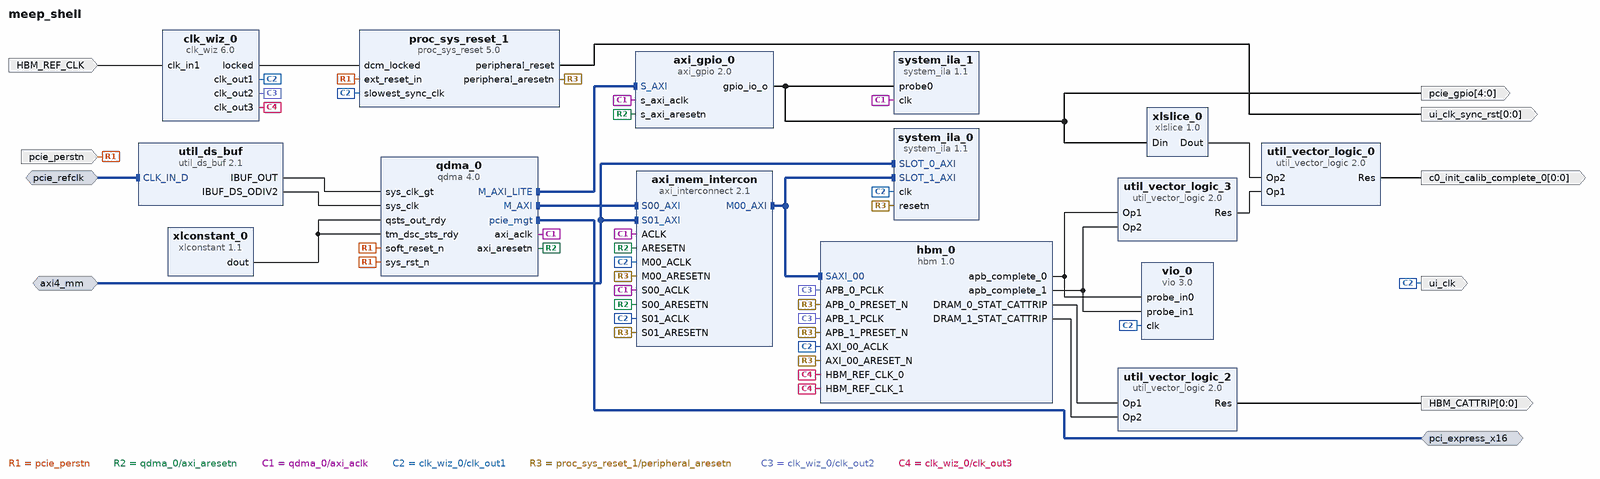
[diagram p0: block diagram of the top level]
# Vivado block design meep_shell, xcu280-fsvh2892-2L-e, Vivado 2020.1
create_bd_design meep_shell

create_bd_intf_port -mode Master -vlnv xilinx.com:interface:pcie_7x_mgt_rtl:1.0 pci_express_x16
create_bd_intf_port -mode Slave -vlnv xilinx.com:interface:diff_clock_rtl:1.0 pcie_refclk
set_property -dict {CONFIG.FREQ_HZ 100000000} [get_bd_intf_ports pcie_refclk]
create_bd_intf_port -mode Slave -vlnv xilinx.com:interface:aximm_rtl:1.0 axi4_mm
set_property -dict [list \
  CONFIG.DATA_WIDTH 512 \
  CONFIG.PROTOCOL AXI4 \
  CONFIG.FREQ_HZ 250000000 \
  CONFIG.ID_WIDTH 7 \
  CONFIG.ADDR_WIDTH 33 \
  CONFIG.AWUSER_WIDTH 0 \
  CONFIG.ARUSER_WIDTH 0 \
  CONFIG.WUSER_WIDTH 0 \
  CONFIG.RUSER_WIDTH 0 \
  CONFIG.BUSER_WIDTH 0 \
  CONFIG.READ_WRITE_MODE READ_WRITE \
  CONFIG.HAS_BURST 1 \
  CONFIG.HAS_LOCK 1 \
  CONFIG.HAS_PROT 1 \
  CONFIG.HAS_CACHE 1 \
  CONFIG.HAS_QOS 1 \
  CONFIG.HAS_REGION 1 \
  CONFIG.HAS_WSTRB 1 \
  CONFIG.HAS_BRESP 1 \
  CONFIG.HAS_RRESP 1 \
  CONFIG.SUPPORTS_NARROW_BURST 1 \
  CONFIG.NUM_READ_OUTSTANDING 1 \
  CONFIG.NUM_WRITE_OUTSTANDING 1 \
  CONFIG.MAX_BURST_LENGTH 256 \
  CONFIG.NUM_READ_THREADS 1 \
  CONFIG.NUM_WRITE_THREADS 1 \
  CONFIG.RUSER_BITS_PER_BYTE 0 \
  CONFIG.WUSER_BITS_PER_BYTE 0 \
] [get_bd_intf_ports axi4_mm]
create_bd_port -dir I -type rst pcie_perstn
set_property -dict {CONFIG.POLARITY ACTIVE_LOW} [get_bd_ports pcie_perstn]
create_bd_port -dir O -from 0 -to 0 c0_init_calib_complete_0
create_bd_port -dir O -type clk ui_clk
create_bd_port -dir O -from 4 -to 0 pcie_gpio
create_bd_port -dir O -from 0 -to 0 HBM_CATTRIP
create_bd_port -dir O -from 0 -to 0 -type rst ui_clk_sync_rst
create_bd_port -dir I -type clk HBM_REF_CLK

create_bd_cell -type ip -vlnv xilinx.com:ip:qdma:4.0 qdma_0
set_property -dict [list \
  CONFIG.PCIE_BOARD_INTERFACE pci_express_x16 \
  CONFIG.PF1_SRIOV_CAP_INITIAL_VF 4 \
  CONFIG.PF2_SRIOV_CAP_INITIAL_VF 4 \
  CONFIG.PF3_SRIOV_CAP_INITIAL_VF 4 \
  CONFIG.SRIOV_CAP_ENABLE true \
  CONFIG.SYS_RST_N_BOARD_INTERFACE pcie_perstn \
  CONFIG.axilite_master_en true \
  CONFIG.barlite_mb_pf0 1 \
  CONFIG.barlite_mb_pf1 1 \
  CONFIG.barlite_mb_pf2 1 \
  CONFIG.barlite_mb_pf3 1 \
  CONFIG.dma_intf_sel_qdma AXI_MM \
  CONFIG.pf0_bar0_prefetchable_qdma true \
  CONFIG.pf0_bar2_64bit_qdma true \
  CONFIG.pf0_bar2_enabled_qdma true \
  CONFIG.pf0_bar2_prefetchable_qdma true \
  CONFIG.tl_pf_enable_reg 4 \
] [get_bd_cells qdma_0]
create_bd_cell -type ip -vlnv xilinx.com:ip:util_ds_buf:2.1 util_ds_buf
set_property -dict {CONFIG.DIFF_CLK_IN_BOARD_INTERFACE pcie_refclk CONFIG.USE_BOARD_FLOW true} [get_bd_cells util_ds_buf]
create_bd_cell -type ip -vlnv xilinx.com:ip:xlconstant:1.1 xlconstant_0
create_bd_cell -type ip -vlnv xilinx.com:ip:axi_gpio:2.0 axi_gpio_0
set_property -dict {CONFIG.C_ALL_OUTPUTS 1 CONFIG.C_GPIO_WIDTH 5} [get_bd_cells axi_gpio_0]
create_bd_cell -type ip -vlnv xilinx.com:ip:hbm:1.0 hbm_0
set_property -dict [list \
  CONFIG.USER_APB_EN false \
  CONFIG.USER_APB_PCLK_0 50 \
  CONFIG.USER_APB_PCLK_1 50 \
  CONFIG.USER_APB_PCLK_PERIOD_0 20.0 \
  CONFIG.USER_APB_PCLK_PERIOD_1 20.0 \
  CONFIG.USER_CLK_SEL_LIST0 AXI_00_ACLK \
  CONFIG.USER_CLK_SEL_LIST1 AXI_16_ACLK \
  CONFIG.USER_HBM_CP_1 6 \
  CONFIG.USER_HBM_DENSITY 8GB \
  CONFIG.USER_HBM_FBDIV_1 36 \
  CONFIG.USER_HBM_HEX_CP_RES_1 0x0000A600 \
  CONFIG.USER_HBM_HEX_FBDIV_CLKOUTDIV_1 0x00000902 \
  CONFIG.USER_HBM_HEX_LOCK_FB_REF_DLY_1 0x00001f1f \
  CONFIG.USER_HBM_LOCK_FB_DLY_1 31 \
  CONFIG.USER_HBM_LOCK_REF_DLY_1 31 \
  CONFIG.USER_HBM_RES_1 10 \
  CONFIG.USER_HBM_STACK 2 \
  CONFIG.USER_MC_ENABLE_08 TRUE \
  CONFIG.USER_MC_ENABLE_09 TRUE \
  CONFIG.USER_MC_ENABLE_10 TRUE \
  CONFIG.USER_MC_ENABLE_11 TRUE \
  CONFIG.USER_MC_ENABLE_12 TRUE \
  CONFIG.USER_MC_ENABLE_13 TRUE \
  CONFIG.USER_MC_ENABLE_14 TRUE \
  CONFIG.USER_MC_ENABLE_15 TRUE \
  CONFIG.USER_MC_ENABLE_APB_01 TRUE \
  CONFIG.USER_PHY_ENABLE_08 TRUE \
  CONFIG.USER_PHY_ENABLE_09 TRUE \
  CONFIG.USER_PHY_ENABLE_10 TRUE \
  CONFIG.USER_PHY_ENABLE_11 TRUE \
  CONFIG.USER_PHY_ENABLE_12 TRUE \
  CONFIG.USER_PHY_ENABLE_13 TRUE \
  CONFIG.USER_PHY_ENABLE_14 TRUE \
  CONFIG.USER_PHY_ENABLE_15 TRUE \
  CONFIG.USER_SAXI_00 true \
  CONFIG.USER_SAXI_01 false \
  CONFIG.USER_SAXI_02 false \
  CONFIG.USER_SAXI_03 false \
  CONFIG.USER_SAXI_04 false \
  CONFIG.USER_SAXI_05 false \
  CONFIG.USER_SAXI_06 false \
  CONFIG.USER_SAXI_07 false \
  CONFIG.USER_SAXI_08 false \
  CONFIG.USER_SAXI_09 false \
  CONFIG.USER_SAXI_10 false \
  CONFIG.USER_SAXI_11 false \
  CONFIG.USER_SAXI_12 false \
  CONFIG.USER_SAXI_13 false \
  CONFIG.USER_SAXI_14 false \
  CONFIG.USER_SAXI_15 false \
  CONFIG.USER_SAXI_16 false \
  CONFIG.USER_SAXI_17 false \
  CONFIG.USER_SAXI_18 false \
  CONFIG.USER_SAXI_19 false \
  CONFIG.USER_SAXI_20 false \
  CONFIG.USER_SAXI_21 false \
  CONFIG.USER_SAXI_22 false \
  CONFIG.USER_SAXI_23 false \
  CONFIG.USER_SAXI_24 false \
  CONFIG.USER_SAXI_25 false \
  CONFIG.USER_SAXI_26 false \
  CONFIG.USER_SAXI_27 false \
  CONFIG.USER_SAXI_28 false \
  CONFIG.USER_SAXI_29 false \
  CONFIG.USER_SAXI_30 false \
  CONFIG.USER_SAXI_31 false \
  CONFIG.USER_SWITCH_ENABLE_01 TRUE \
  CONFIG.USER_TEMP_POLL_CNT_0 50000 \
  CONFIG.USER_TEMP_POLL_CNT_1 50000 \
  CONFIG.USER_XSDB_INTF_EN TRUE \
] [get_bd_cells hbm_0]
create_bd_cell -type ip -vlnv xilinx.com:ip:axi_interconnect:2.1 axi_mem_intercon
set_property -dict [list \
  CONFIG.ENABLE_ADVANCED_OPTIONS 1 \
  CONFIG.NUM_MI 1 \
  CONFIG.NUM_SI 2 \
  CONFIG.SYNCHRONIZATION_STAGES 8 \
  CONFIG.XBAR_DATA_WIDTH 256 \
] [get_bd_cells axi_mem_intercon]
create_bd_cell -type ip -vlnv xilinx.com:ip:util_vector_logic:2.0 util_vector_logic_0
set_property -dict {CONFIG.C_SIZE 1} [get_bd_cells util_vector_logic_0]
create_bd_cell -type ip -vlnv xilinx.com:ip:xlslice:1.0 xlslice_0
set_property -dict {CONFIG.DIN_FROM 0 CONFIG.DIN_WIDTH 5 CONFIG.DOUT_WIDTH 1} [get_bd_cells xlslice_0]
create_bd_cell -type ip -vlnv xilinx.com:ip:clk_wiz:6.0 clk_wiz_0
set_property -dict [list \
  CONFIG.CLKOUT1_DRIVES Buffer \
  CONFIG.CLKOUT1_JITTER 110.209 \
  CONFIG.CLKOUT1_PHASE_ERROR 98.575 \
  CONFIG.CLKOUT1_REQUESTED_OUT_FREQ 250.000 \
  CONFIG.CLKOUT2_DRIVES Buffer \
  CONFIG.CLKOUT2_JITTER 151.636 \
  CONFIG.CLKOUT2_PHASE_ERROR 98.575 \
  CONFIG.CLKOUT2_REQUESTED_OUT_FREQ 50.000 \
  CONFIG.CLKOUT2_USED true \
  CONFIG.CLKOUT3_DRIVES Buffer \
  CONFIG.CLKOUT3_JITTER 130.958 \
  CONFIG.CLKOUT3_PHASE_ERROR 98.575 \
  CONFIG.CLKOUT3_USED true \
  CONFIG.CLKOUT4_DRIVES Buffer \
  CONFIG.CLKOUT5_DRIVES Buffer \
  CONFIG.CLKOUT6_DRIVES Buffer \
  CONFIG.CLKOUT7_DRIVES Buffer \
  CONFIG.CLK_IN1_BOARD_INTERFACE Custom \
  CONFIG.FEEDBACK_SOURCE FDBK_AUTO \
  CONFIG.MMCM_CLKFBOUT_MULT_F 10.000 \
  CONFIG.MMCM_CLKOUT0_DIVIDE_F 4.000 \
  CONFIG.MMCM_CLKOUT1_DIVIDE 20 \
  CONFIG.MMCM_CLKOUT2_DIVIDE 10 \
  CONFIG.NUM_OUT_CLKS 3 \
  CONFIG.PRIM_SOURCE Single_ended_clock_capable_pin \
  CONFIG.USE_LOCKED true \
  CONFIG.USE_RESET false \
  CONFIG.USE_SAFE_CLOCK_STARTUP false \
] [get_bd_cells clk_wiz_0]
create_bd_cell -type ip -vlnv xilinx.com:ip:system_ila:1.1 system_ila_1
set_property -dict {CONFIG.C_MON_TYPE NATIVE CONFIG.C_NUM_OF_PROBES 1 CONFIG.C_PROBE0_TYPE 0} [get_bd_cells system_ila_1]
create_bd_cell -type ip -vlnv xilinx.com:ip:proc_sys_reset:5.0 proc_sys_reset_1
create_bd_cell -type ip -vlnv xilinx.com:ip:util_vector_logic:2.0 util_vector_logic_2
set_property -dict {CONFIG.C_SIZE 1} [get_bd_cells util_vector_logic_2]
create_bd_cell -type ip -vlnv xilinx.com:ip:util_vector_logic:2.0 util_vector_logic_3
set_property -dict {CONFIG.C_SIZE 1} [get_bd_cells util_vector_logic_3]
create_bd_cell -type ip -vlnv xilinx.com:ip:system_ila:1.1 system_ila_0
set_property -dict [list \
  CONFIG.C_MON_TYPE INTERFACE \
  CONFIG.C_NUM_MONITOR_SLOTS 2 \
  CONFIG.C_SLOT_0_APC_EN 0 \
  CONFIG.C_SLOT_0_AXI_AR_SEL_DATA 1 \
  CONFIG.C_SLOT_0_AXI_AR_SEL_TRIG 1 \
  CONFIG.C_SLOT_0_AXI_AW_SEL_DATA 1 \
  CONFIG.C_SLOT_0_AXI_AW_SEL_TRIG 1 \
  CONFIG.C_SLOT_0_AXI_B_SEL_DATA 1 \
  CONFIG.C_SLOT_0_AXI_B_SEL_TRIG 1 \
  CONFIG.C_SLOT_0_AXI_R_SEL_DATA 1 \
  CONFIG.C_SLOT_0_AXI_R_SEL_TRIG 1 \
  CONFIG.C_SLOT_0_AXI_W_SEL_DATA 1 \
  CONFIG.C_SLOT_0_AXI_W_SEL_TRIG 1 \
  CONFIG.C_SLOT_0_INTF_TYPE xilinx.com:interface:aximm_rtl:1.0 \
  CONFIG.C_SLOT_1_APC_EN 0 \
  CONFIG.C_SLOT_1_AXI_AR_SEL_DATA 1 \
  CONFIG.C_SLOT_1_AXI_AR_SEL_TRIG 1 \
  CONFIG.C_SLOT_1_AXI_AW_SEL_DATA 1 \
  CONFIG.C_SLOT_1_AXI_AW_SEL_TRIG 1 \
  CONFIG.C_SLOT_1_AXI_B_SEL_DATA 1 \
  CONFIG.C_SLOT_1_AXI_B_SEL_TRIG 1 \
  CONFIG.C_SLOT_1_AXI_R_SEL_DATA 1 \
  CONFIG.C_SLOT_1_AXI_R_SEL_TRIG 1 \
  CONFIG.C_SLOT_1_AXI_W_SEL_DATA 1 \
  CONFIG.C_SLOT_1_AXI_W_SEL_TRIG 1 \
  CONFIG.C_SLOT_1_INTF_TYPE xilinx.com:interface:aximm_rtl:1.0 \
] [get_bd_cells system_ila_0]
create_bd_cell -type ip -vlnv xilinx.com:ip:vio:3.0 vio_0
set_property -dict {CONFIG.C_NUM_PROBE_IN 2 CONFIG.C_NUM_PROBE_OUT 0} [get_bd_cells vio_0]

# ---- connections ----

connect_bd_intf_net [get_bd_intf_pins qdma_0/M_AXI_LITE] [get_bd_intf_pins axi_gpio_0/S_AXI]
connect_bd_intf_net [get_bd_intf_ports pcie_refclk] [get_bd_intf_pins util_ds_buf/CLK_IN_D]
connect_bd_intf_net -intf_net axi_mem_intercon_M00_AXI [get_bd_intf_pins axi_mem_intercon/M00_AXI] [get_bd_intf_pins hbm_0/SAXI_00]
connect_bd_intf_net [get_bd_intf_pins axi_mem_intercon/M00_AXI] [get_bd_intf_pins system_ila_0/SLOT_1_AXI]
connect_bd_intf_net [get_bd_intf_pins qdma_0/M_AXI] [get_bd_intf_pins axi_mem_intercon/S00_AXI]
connect_bd_intf_net [get_bd_intf_ports pci_express_x16] [get_bd_intf_pins qdma_0/pcie_mgt]
connect_bd_intf_net -intf_net axi4_mm_1 [get_bd_intf_ports axi4_mm] [get_bd_intf_pins axi_mem_intercon/S01_AXI]
connect_bd_intf_net [get_bd_intf_ports axi4_mm] [get_bd_intf_pins system_ila_0/SLOT_0_AXI]
connect_bd_net [get_bd_ports pcie_perstn] [get_bd_pins qdma_0/sys_rst_n] [get_bd_pins qdma_0/soft_reset_n] [get_bd_pins proc_sys_reset_1/ext_reset_in]
connect_bd_net [get_bd_pins util_ds_buf/IBUF_OUT] [get_bd_pins qdma_0/sys_clk_gt]
connect_bd_net [get_bd_pins util_ds_buf/IBUF_DS_ODIV2] [get_bd_pins qdma_0/sys_clk]
connect_bd_net [get_bd_pins qdma_0/axi_aresetn] \
  [get_bd_pins axi_gpio_0/s_axi_aresetn] [get_bd_pins axi_mem_intercon/S00_ARESETN] [get_bd_pins axi_mem_intercon/ARESETN]
connect_bd_net [get_bd_pins qdma_0/axi_aclk] \
  [get_bd_pins axi_gpio_0/s_axi_aclk] [get_bd_pins axi_mem_intercon/S00_ACLK] [get_bd_pins axi_mem_intercon/ACLK] \
  [get_bd_pins system_ila_1/clk]
connect_bd_net [get_bd_pins xlconstant_0/dout] [get_bd_pins qdma_0/tm_dsc_sts_rdy] [get_bd_pins qdma_0/qsts_out_rdy]
connect_bd_net -net axi_gpio_0_gpio_io_o [get_bd_pins axi_gpio_0/gpio_io_o] \
  [get_bd_ports pcie_gpio] [get_bd_pins xlslice_0/Din] [get_bd_pins system_ila_1/probe0]
connect_bd_net -net HBM_REF_CLK_0_0_1 [get_bd_ports HBM_REF_CLK] [get_bd_pins clk_wiz_0/clk_in1]
connect_bd_net [get_bd_pins util_vector_logic_0/Res] [get_bd_ports c0_init_calib_complete_0]
connect_bd_net [get_bd_pins xlslice_0/Dout] [get_bd_pins util_vector_logic_0/Op2]
connect_bd_net [get_bd_pins clk_wiz_0/clk_out1] \
  [get_bd_pins hbm_0/AXI_00_ACLK] [get_bd_pins axi_mem_intercon/M00_ACLK] [get_bd_pins axi_mem_intercon/S01_ACLK] \
  [get_bd_pins proc_sys_reset_1/slowest_sync_clk] [get_bd_ports ui_clk] [get_bd_pins system_ila_0/clk] \
  [get_bd_pins vio_0/clk]
connect_bd_net [get_bd_pins proc_sys_reset_1/peripheral_aresetn] \
  [get_bd_pins hbm_0/AXI_00_ARESET_N] [get_bd_pins axi_mem_intercon/S01_ARESETN] [get_bd_pins axi_mem_intercon/M00_ARESETN] \
  [get_bd_pins system_ila_0/resetn] [get_bd_pins hbm_0/APB_0_PRESET_N] [get_bd_pins hbm_0/APB_1_PRESET_N]
connect_bd_net [get_bd_pins util_vector_logic_2/Res] [get_bd_ports HBM_CATTRIP]
connect_bd_net [get_bd_pins hbm_0/DRAM_0_STAT_CATTRIP] [get_bd_pins util_vector_logic_2/Op1]
connect_bd_net [get_bd_pins hbm_0/DRAM_1_STAT_CATTRIP] [get_bd_pins util_vector_logic_2/Op2]
connect_bd_net [get_bd_pins clk_wiz_0/clk_out2] [get_bd_pins hbm_0/APB_1_PCLK] [get_bd_pins hbm_0/APB_0_PCLK]
connect_bd_net [get_bd_pins hbm_0/apb_complete_0] [get_bd_pins util_vector_logic_3/Op1] [get_bd_pins vio_0/probe_in0]
connect_bd_net [get_bd_pins hbm_0/apb_complete_1] [get_bd_pins util_vector_logic_3/Op2] [get_bd_pins vio_0/probe_in1]
connect_bd_net [get_bd_pins util_vector_logic_3/Res] [get_bd_pins util_vector_logic_0/Op1]
connect_bd_net [get_bd_pins proc_sys_reset_1/peripheral_reset] [get_bd_ports ui_clk_sync_rst]
connect_bd_net [get_bd_pins clk_wiz_0/locked] [get_bd_pins proc_sys_reset_1/dcm_locked]
connect_bd_net [get_bd_pins clk_wiz_0/clk_out3] [get_bd_pins hbm_0/HBM_REF_CLK_0] [get_bd_pins hbm_0/HBM_REF_CLK_1]
set_property HDL_ATTRIBUTE.DEBUG true [get_bd_intf_nets axi_mem_intercon_M00_AXI]
set_property HDL_ATTRIBUTE.MARK_DEBUG true [get_bd_intf_nets axi_mem_intercon_M00_AXI]
set_property HDL_ATTRIBUTE.DEBUG true [get_bd_intf_nets axi4_mm_1]
set_property HDL_ATTRIBUTE.MARK_DEBUG true [get_bd_intf_nets axi4_mm_1]
set_property HDL_ATTRIBUTE.DEBUG true [get_bd_nets axi_gpio_0_gpio_io_o]
set_property HDL_ATTRIBUTE.MARK_DEBUG true [get_bd_nets axi_gpio_0_gpio_io_o]

# ---- address map ----
assign_bd_address -offset 0x000000000 -range 256M -target_address_space [get_bd_addr_spaces axi4_mm] [get_bd_addr_segs hbm_0/SAXI_00/HBM_MEM00]
assign_bd_address -offset 0x010000000 -range 256M -target_address_space [get_bd_addr_spaces axi4_mm] [get_bd_addr_segs hbm_0/SAXI_00/HBM_MEM01]
assign_bd_address -offset 0x020000000 -range 256M -target_address_space [get_bd_addr_spaces axi4_mm] [get_bd_addr_segs hbm_0/SAXI_00/HBM_MEM02]
assign_bd_address -offset 0x030000000 -range 256M -target_address_space [get_bd_addr_spaces axi4_mm] [get_bd_addr_segs hbm_0/SAXI_00/HBM_MEM03]
assign_bd_address -offset 0x040000000 -range 256M -target_address_space [get_bd_addr_spaces axi4_mm] [get_bd_addr_segs hbm_0/SAXI_00/HBM_MEM04]
assign_bd_address -offset 0x050000000 -range 256M -target_address_space [get_bd_addr_spaces axi4_mm] [get_bd_addr_segs hbm_0/SAXI_00/HBM_MEM05]
assign_bd_address -offset 0x060000000 -range 256M -target_address_space [get_bd_addr_spaces axi4_mm] [get_bd_addr_segs hbm_0/SAXI_00/HBM_MEM06]
assign_bd_address -offset 0x070000000 -range 256M -target_address_space [get_bd_addr_spaces axi4_mm] [get_bd_addr_segs hbm_0/SAXI_00/HBM_MEM07]
assign_bd_address -offset 0x080000000 -range 256M -target_address_space [get_bd_addr_spaces axi4_mm] [get_bd_addr_segs hbm_0/SAXI_00/HBM_MEM08]
assign_bd_address -offset 0x090000000 -range 256M -target_address_space [get_bd_addr_spaces axi4_mm] [get_bd_addr_segs hbm_0/SAXI_00/HBM_MEM09]
assign_bd_address -offset 0x0A0000000 -range 256M -target_address_space [get_bd_addr_spaces axi4_mm] [get_bd_addr_segs hbm_0/SAXI_00/HBM_MEM10]
assign_bd_address -offset 0x0B0000000 -range 256M -target_address_space [get_bd_addr_spaces axi4_mm] [get_bd_addr_segs hbm_0/SAXI_00/HBM_MEM11]
assign_bd_address -offset 0x0C0000000 -range 256M -target_address_space [get_bd_addr_spaces axi4_mm] [get_bd_addr_segs hbm_0/SAXI_00/HBM_MEM12]
assign_bd_address -offset 0x0D0000000 -range 256M -target_address_space [get_bd_addr_spaces axi4_mm] [get_bd_addr_segs hbm_0/SAXI_00/HBM_MEM13]
assign_bd_address -offset 0x0E0000000 -range 256M -target_address_space [get_bd_addr_spaces axi4_mm] [get_bd_addr_segs hbm_0/SAXI_00/HBM_MEM14]
assign_bd_address -offset 0x0F0000000 -range 256M -target_address_space [get_bd_addr_spaces axi4_mm] [get_bd_addr_segs hbm_0/SAXI_00/HBM_MEM15]
assign_bd_address -offset 0x100000000 -range 256M -target_address_space [get_bd_addr_spaces axi4_mm] [get_bd_addr_segs hbm_0/SAXI_00/HBM_MEM16]
assign_bd_address -offset 0x110000000 -range 256M -target_address_space [get_bd_addr_spaces axi4_mm] [get_bd_addr_segs hbm_0/SAXI_00/HBM_MEM17]
assign_bd_address -offset 0x120000000 -range 256M -target_address_space [get_bd_addr_spaces axi4_mm] [get_bd_addr_segs hbm_0/SAXI_00/HBM_MEM18]
assign_bd_address -offset 0x130000000 -range 256M -target_address_space [get_bd_addr_spaces axi4_mm] [get_bd_addr_segs hbm_0/SAXI_00/HBM_MEM19]
assign_bd_address -offset 0x140000000 -range 256M -target_address_space [get_bd_addr_spaces axi4_mm] [get_bd_addr_segs hbm_0/SAXI_00/HBM_MEM20]
assign_bd_address -offset 0x150000000 -range 256M -target_address_space [get_bd_addr_spaces axi4_mm] [get_bd_addr_segs hbm_0/SAXI_00/HBM_MEM21]
assign_bd_address -offset 0x160000000 -range 256M -target_address_space [get_bd_addr_spaces axi4_mm] [get_bd_addr_segs hbm_0/SAXI_00/HBM_MEM22]
assign_bd_address -offset 0x170000000 -range 256M -target_address_space [get_bd_addr_spaces axi4_mm] [get_bd_addr_segs hbm_0/SAXI_00/HBM_MEM23]
assign_bd_address -offset 0x180000000 -range 256M -target_address_space [get_bd_addr_spaces axi4_mm] [get_bd_addr_segs hbm_0/SAXI_00/HBM_MEM24]
assign_bd_address -offset 0x190000000 -range 256M -target_address_space [get_bd_addr_spaces axi4_mm] [get_bd_addr_segs hbm_0/SAXI_00/HBM_MEM25]
assign_bd_address -offset 0x1A0000000 -range 256M -target_address_space [get_bd_addr_spaces axi4_mm] [get_bd_addr_segs hbm_0/SAXI_00/HBM_MEM26]
assign_bd_address -offset 0x1B0000000 -range 256M -target_address_space [get_bd_addr_spaces axi4_mm] [get_bd_addr_segs hbm_0/SAXI_00/HBM_MEM27]
assign_bd_address -offset 0x1C0000000 -range 256M -target_address_space [get_bd_addr_spaces axi4_mm] [get_bd_addr_segs hbm_0/SAXI_00/HBM_MEM28]
assign_bd_address -offset 0x1D0000000 -range 256M -target_address_space [get_bd_addr_spaces axi4_mm] [get_bd_addr_segs hbm_0/SAXI_00/HBM_MEM29]
assign_bd_address -offset 0x1E0000000 -range 256M -target_address_space [get_bd_addr_spaces axi4_mm] [get_bd_addr_segs hbm_0/SAXI_00/HBM_MEM30]
assign_bd_address -offset 0x1F0000000 -range 256M -target_address_space [get_bd_addr_spaces axi4_mm] [get_bd_addr_segs hbm_0/SAXI_00/HBM_MEM31]
assign_bd_address -offset 0x0000000000000000 -range 256M -target_address_space [get_bd_addr_spaces qdma_0/M_AXI] [get_bd_addr_segs hbm_0/SAXI_00/HBM_MEM00]
assign_bd_address -offset 0x0000000010000000 -range 256M -target_address_space [get_bd_addr_spaces qdma_0/M_AXI] [get_bd_addr_segs hbm_0/SAXI_00/HBM_MEM01]
assign_bd_address -offset 0x0000000020000000 -range 256M -target_address_space [get_bd_addr_spaces qdma_0/M_AXI] [get_bd_addr_segs hbm_0/SAXI_00/HBM_MEM02]
assign_bd_address -offset 0x0000000030000000 -range 256M -target_address_space [get_bd_addr_spaces qdma_0/M_AXI] [get_bd_addr_segs hbm_0/SAXI_00/HBM_MEM03]
assign_bd_address -offset 0x0000000040000000 -range 256M -target_address_space [get_bd_addr_spaces qdma_0/M_AXI] [get_bd_addr_segs hbm_0/SAXI_00/HBM_MEM04]
assign_bd_address -offset 0x0000000050000000 -range 256M -target_address_space [get_bd_addr_spaces qdma_0/M_AXI] [get_bd_addr_segs hbm_0/SAXI_00/HBM_MEM05]
assign_bd_address -offset 0x0000000060000000 -range 256M -target_address_space [get_bd_addr_spaces qdma_0/M_AXI] [get_bd_addr_segs hbm_0/SAXI_00/HBM_MEM06]
assign_bd_address -offset 0x0000000070000000 -range 256M -target_address_space [get_bd_addr_spaces qdma_0/M_AXI] [get_bd_addr_segs hbm_0/SAXI_00/HBM_MEM07]
assign_bd_address -offset 0x0000000080000000 -range 256M -target_address_space [get_bd_addr_spaces qdma_0/M_AXI] [get_bd_addr_segs hbm_0/SAXI_00/HBM_MEM08]
assign_bd_address -offset 0x0000000090000000 -range 256M -target_address_space [get_bd_addr_spaces qdma_0/M_AXI] [get_bd_addr_segs hbm_0/SAXI_00/HBM_MEM09]
assign_bd_address -offset 0x00000000A0000000 -range 256M -target_address_space [get_bd_addr_spaces qdma_0/M_AXI] [get_bd_addr_segs hbm_0/SAXI_00/HBM_MEM10]
assign_bd_address -offset 0x00000000B0000000 -range 256M -target_address_space [get_bd_addr_spaces qdma_0/M_AXI] [get_bd_addr_segs hbm_0/SAXI_00/HBM_MEM11]
assign_bd_address -offset 0x00000000C0000000 -range 256M -target_address_space [get_bd_addr_spaces qdma_0/M_AXI] [get_bd_addr_segs hbm_0/SAXI_00/HBM_MEM12]
assign_bd_address -offset 0x00000000D0000000 -range 256M -target_address_space [get_bd_addr_spaces qdma_0/M_AXI] [get_bd_addr_segs hbm_0/SAXI_00/HBM_MEM13]
assign_bd_address -offset 0x00000000E0000000 -range 256M -target_address_space [get_bd_addr_spaces qdma_0/M_AXI] [get_bd_addr_segs hbm_0/SAXI_00/HBM_MEM14]
assign_bd_address -offset 0x00000000F0000000 -range 256M -target_address_space [get_bd_addr_spaces qdma_0/M_AXI] [get_bd_addr_segs hbm_0/SAXI_00/HBM_MEM15]
assign_bd_address -offset 0x0000000100000000 -range 256M -target_address_space [get_bd_addr_spaces qdma_0/M_AXI] [get_bd_addr_segs hbm_0/SAXI_00/HBM_MEM16]
assign_bd_address -offset 0x0000000110000000 -range 256M -target_address_space [get_bd_addr_spaces qdma_0/M_AXI] [get_bd_addr_segs hbm_0/SAXI_00/HBM_MEM17]
assign_bd_address -offset 0x0000000120000000 -range 256M -target_address_space [get_bd_addr_spaces qdma_0/M_AXI] [get_bd_addr_segs hbm_0/SAXI_00/HBM_MEM18]
assign_bd_address -offset 0x0000000130000000 -range 256M -target_address_space [get_bd_addr_spaces qdma_0/M_AXI] [get_bd_addr_segs hbm_0/SAXI_00/HBM_MEM19]
assign_bd_address -offset 0x0000000140000000 -range 256M -target_address_space [get_bd_addr_spaces qdma_0/M_AXI] [get_bd_addr_segs hbm_0/SAXI_00/HBM_MEM20]
assign_bd_address -offset 0x0000000150000000 -range 256M -target_address_space [get_bd_addr_spaces qdma_0/M_AXI] [get_bd_addr_segs hbm_0/SAXI_00/HBM_MEM21]
assign_bd_address -offset 0x0000000160000000 -range 256M -target_address_space [get_bd_addr_spaces qdma_0/M_AXI] [get_bd_addr_segs hbm_0/SAXI_00/HBM_MEM22]
assign_bd_address -offset 0x0000000170000000 -range 256M -target_address_space [get_bd_addr_spaces qdma_0/M_AXI] [get_bd_addr_segs hbm_0/SAXI_00/HBM_MEM23]
assign_bd_address -offset 0x0000000180000000 -range 256M -target_address_space [get_bd_addr_spaces qdma_0/M_AXI] [get_bd_addr_segs hbm_0/SAXI_00/HBM_MEM24]
assign_bd_address -offset 0x0000000190000000 -range 256M -target_address_space [get_bd_addr_spaces qdma_0/M_AXI] [get_bd_addr_segs hbm_0/SAXI_00/HBM_MEM25]
assign_bd_address -offset 0x00000001A0000000 -range 256M -target_address_space [get_bd_addr_spaces qdma_0/M_AXI] [get_bd_addr_segs hbm_0/SAXI_00/HBM_MEM26]
assign_bd_address -offset 0x00000001B0000000 -range 256M -target_address_space [get_bd_addr_spaces qdma_0/M_AXI] [get_bd_addr_segs hbm_0/SAXI_00/HBM_MEM27]
assign_bd_address -offset 0x00000001C0000000 -range 256M -target_address_space [get_bd_addr_spaces qdma_0/M_AXI] [get_bd_addr_segs hbm_0/SAXI_00/HBM_MEM28]
assign_bd_address -offset 0x00000001D0000000 -range 256M -target_address_space [get_bd_addr_spaces qdma_0/M_AXI] [get_bd_addr_segs hbm_0/SAXI_00/HBM_MEM29]
assign_bd_address -offset 0x00000001E0000000 -range 256M -target_address_space [get_bd_addr_spaces qdma_0/M_AXI] [get_bd_addr_segs hbm_0/SAXI_00/HBM_MEM30]
assign_bd_address -offset 0x00000001F0000000 -range 256M -target_address_space [get_bd_addr_spaces qdma_0/M_AXI] [get_bd_addr_segs hbm_0/SAXI_00/HBM_MEM31]
assign_bd_address -offset 0x00000000 -range 64K -target_address_space [get_bd_addr_spaces qdma_0/M_AXI_LITE] [get_bd_addr_segs axi_gpio_0/S_AXI/Reg]

validate_bd_design
save_bd_design
